# Altium schematic sheet 5V_REG.SchDoc
size A4; SheetNumber: 4; SheetTotal: 12
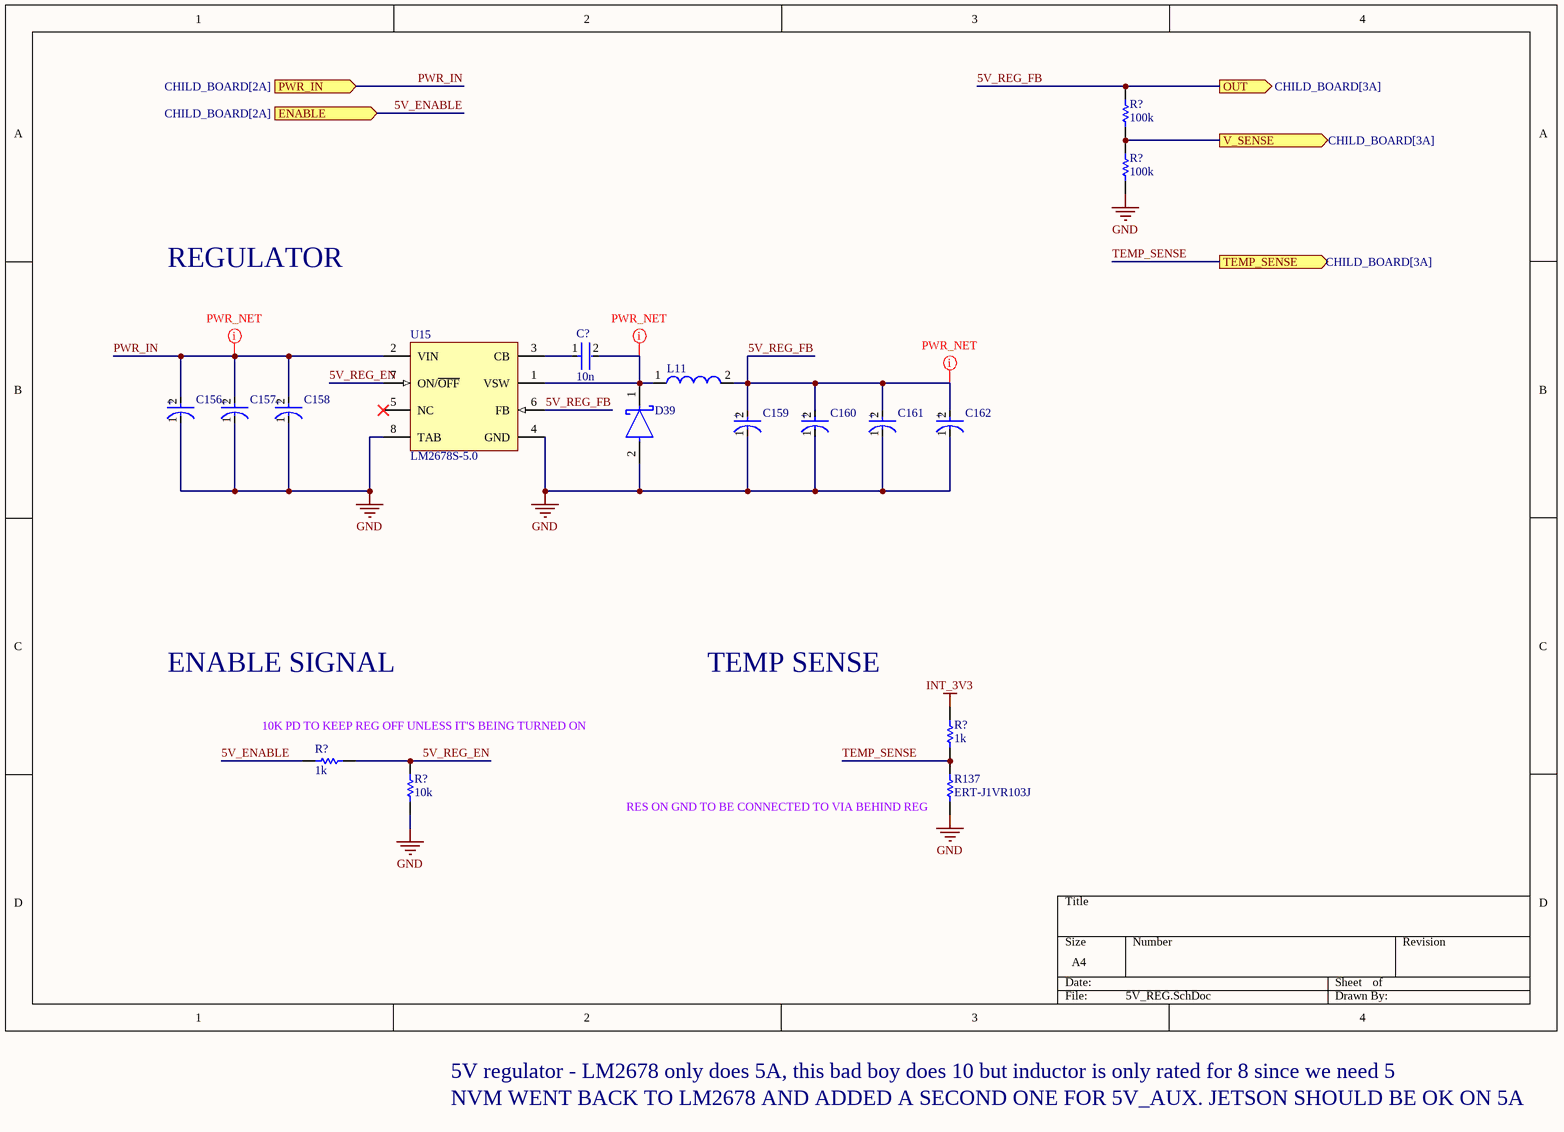
[diagram p0: 5V_REG.SchDoc]

## Parts
(Parts that share a designator on the sheet are numbered #1, #2 ... from top to bottom, then left to right.)
C156  20SVP33M  [FP-OS-CON-SMT-E7-MFG]  (value not drawn)
C157  20SVP33M  [FP-OS-CON-SMT-E7-MFG]  (value not drawn)
C158  20SVP33M  [FP-OS-CON-SMT-E7-MFG]  (value not drawn)
C159  EEE-1AA101WR  [FP-SC-MFG]  (value not drawn)
C160  EEE-1AA101WR  [FP-SC-MFG]  (value not drawn)
C161  EEE-1AA101WR  [FP-SC-MFG]  (value not drawn)
C162  EEE-1AA101WR  [FP-SC-MFG]  (value not drawn)
C?  10n  [FP-0402-L_1_0_0_05-W_0_5-IPC_A]
D39  B540C-13-F  [FP-SMC-MFG]  (value not drawn)
L11  74477110  [WE-PD-L]  (value not drawn)
R137  ERT-J1VR103J  [RESC1608X90X30ML15T20]
R?#1  100k  [R0603B]
R?#2  100k  [R0603B]
R?#3  1k  [R0603B]
R?#4  1k  [R0603B]
R?#5  10k  [R0603B]
U15  LM2678S-5.0  [KTW0007B_N]

## Ports
ENABLE (in, see CHILD_BOARD[2A]), OUT (out, see CHILD_BOARD[3A]), PWR_IN (in, see CHILD_BOARD[2A]), TEMP_SENSE (out, see CHILD_BOARD[3A]), V_SENSE (out, see CHILD_BOARD[3A])

## Nets
GND: C156.1(C) C157.1(C) C158.1(C) C159.1(C) C160.1(C) C161.1(C) C162.1(C) D39.2(A) R137.1 R?#2.2 R?#5.2 U15.4(GND) U15.8(TAB)
INT_3V3: R?#3.1
5V_ENABLE: R?#4.2 ; port ENABLE
5V_REG_EN: R?#4.1 R?#5.1 U15.7(ON/~{OFF})
5V_REG_FB: C159.2(A) C160.2(A) C161.2(A) C162.2(A) L11.2 R?#1.1 U15.6(FB) ; port OUT
PWR_IN: C156.2(A) C157.2(A) C158.2(A) U15.2(VIN) ; port PWR_IN
TEMP_SENSE: R137.2 R?#3.2 ; port TEMP_SENSE
V_SENSE: R?#1.2 R?#2.1 ; port V_SENSE
NetC?_1: C?.1 U15.3(CB)
NetC?_2: C?.2 D39.1(C) L11.1 U15.1(VSW)

Not connected (* = marked no-connect by the designer): U15 5(NC)*

## Layout directives
net class PWR: 5V_REG_FB, NetC?_2, PWR_IN

## Notes on the sheet
- REGULATOR
- ENABLE SIGNAL
- TEMP SENSE
- (near R?#4) 10K PD TO KEEP REG OFF UNLESS IT'S BEING TURNED ON
- RES ON GND TO BE CONNECTED TO VIA BEHIND REG
- 5V regulator - LM2678 only does 5A, this bad boy does 10 but inductor is only rated for 8 since we need 5
- NVM WENT BACK TO LM2678 AND ADDED A SECOND ONE FOR 5V_AUX. JETSON SHOULD BE OK ON 5A
- (in symbol CMP-05427-000047-1) +
- (in symbol CMP-05428-001387-1) +

## Library data of the parts
C156-C158 = CMP-05428-001387-1: Conductive Polymer Aluminum Solid Capacitors (OS-CON) 33uF ±20% 20V RADIAL SMT 8x6.9mm; Polarity: Polar; Life (Hours): 2000Hour; Leakage Current: 132uA; ESR (Equivalent Series Resistance): 45mR; Ripple Current (AC): 1.89A; Dissipation Factor: 12%; Construction: Cylindrical; Capacitance: 33uF; Max Operating Temperature: 105°C; Min Operating Temperature: -55°C; Voltage: 20V; Number of Pins: 7; Termination: SMD/SMT; Package Quantity: 1000; Packaging: Tape and Reel; REACH SVHC: No SVHC; Mount: Surface Mount; Tolerance: 20%; Voltage Rating (DC): 20V; Height: 6.9mm; Series: OS-CON™, SVP; Diameter: 8mm; Length: 6.9mm; Ripple Current: 1.89A; RoHS Compliant: Yes; Height - Seated (Max): 0.276inch; Case/Package: Radial; Voltage Rating: 20V
C159-C162 = CMP-05427-000047-1: CAP ALUM 100UF 20% 10V SMD; Life (Hours): 1000Hour; Ripple Current: 50mA; Packaging: Tape and Reel; Diameter: 5mm; Voltage Rating (DC): 10V; Mount: Surface Mount; Max Operating Temperature: 85°C; Length: 5.5mm; Case/Package: Radial; Height: 5.4mm; Construction: Cylindrical; Termination: SMD/SMT; Height - Seated (Max): 0.213inch; Series: S; Min Operating Temperature: -40°C; Capacitance: 100uF; Tolerance: 20%; Voltage Rating: 10V; Package Quantity: 1; Radiation Hardening: No; Ripple Current (AC): 50mA; Lead Free: Lead Free; RoHS Compliant: Yes; Contact Plating: Tin
C? = CMP-001-00058-1: LARGE PADS, 0402 CAP, CHANGE COMMENT TO MATCH REAL P/N; Capacitor Type: Ceramic; Min Operating Temperature: -55°C; Mounting Technology: Surface Mount; Pins: 2; Case/Package: 0402; RoHS Compliant: Yes; Max Operating Temperature: 85°C
D39 = CMP-2000-05097-3: DIODE SCHOTTKY 40V 5A SMC; Manufacturer: Diodes Inc.; Automotive Grade: NA; Peak Reverse Current: 0.5mA; Value: 300pF; Max Junction Temp: +150°C; Max Surge Forward Current: 100A; Standoff Height: 0.1mm; Digikey Description: DIODE SCHOTTKY 40V 5A SMC; Temperature Range Low: -55°C; Manufacturer Part Number: B540C-13-F; Octopart: https://octopart.com/b540c-13-f-diodes+inc.-325873; Lead Free: Yes; Reverse Voltage: 40V; RoHS: TRUE; Category: Diode; Mouser Description: Diode: Schottky rectifying; SMD; 40V; 5A; SMC; Package: reel, tape; ComponentLink2Description: Datasheet; Temperature Range High: +150°C; Automotive: No; Footprint Url: https://www.diodes.com/assets/Package-Files/SMC.pdf; Device Class L3: Schottky Diodes; Height: 2.5mm; Forward Current: 5A; Temperature: -55°C to +150°C; Package: SMC; ComponentLink2URL: https://www.diodes.com/assets/Datasheets/ds13012.pdf; Device Class L2: Diodes; Max Repetitive Reverse Voltage: 40V; Device Class L1: Discrete Semiconductors; Capacitance: 300pF
L11 = CMP-0227-00708-1: SMD-Shielded Power Inductor WE-PD, L = 10.0 µH; Inductance: 10.0 ÂµH; ComponentLink2Description: Datasheet; DatasheetVersion: ver 7, Sep-2006; PackageVersion: 2006; ComponentLink1URL: http://www.we-online.com; ComponentLink1Description: Manufacturer Link; ComponentLink2URL: http://www.we-online.de/katalog/media/pdf/74477110.pdf; PackageDescription: SMD Inductor, 2-Leads, Body 12.0 x 12.0 mm; PackageReference: WE-PD-L
R137 = CMP-2000-00869-1: Manufacturer: Panasonic; Part Number: ERT-J1VR103J
R?#1-R?#5 = CMP-009-00002-14: Resistor
  R?#1 R?#2: Value: 100k
  R?#3 R?#4: Value: 1k
  R?#5: Value: 10k
U15 = CMP-0069-00190-3: SIMPLE SWITCHER® High Efficiency 5A Step-Down Voltage Regulator, 7-pin TO-263; Manufacturer: Texas Instruments; PowerWise: N; PackageTopMarking: NSUZXYTTE#*LM2678*S-5.0; RoHS: N; PinCount: 7; Code_JEDEC: MO-169-AC; ComponentLink1URL: http://www.ti.com/general/docs/lit/getliterature.tsp?genericPartNumber=LM2678&fileType=pdf; ComponentLink1Description: Datasheet URL; PackageReference: KTW0007B; PackageDescription: TO-263, Molded, .400 x .390 x .180in Body, 7 Lead, .050in Pitch, Surface Mount; CompType: Switcher